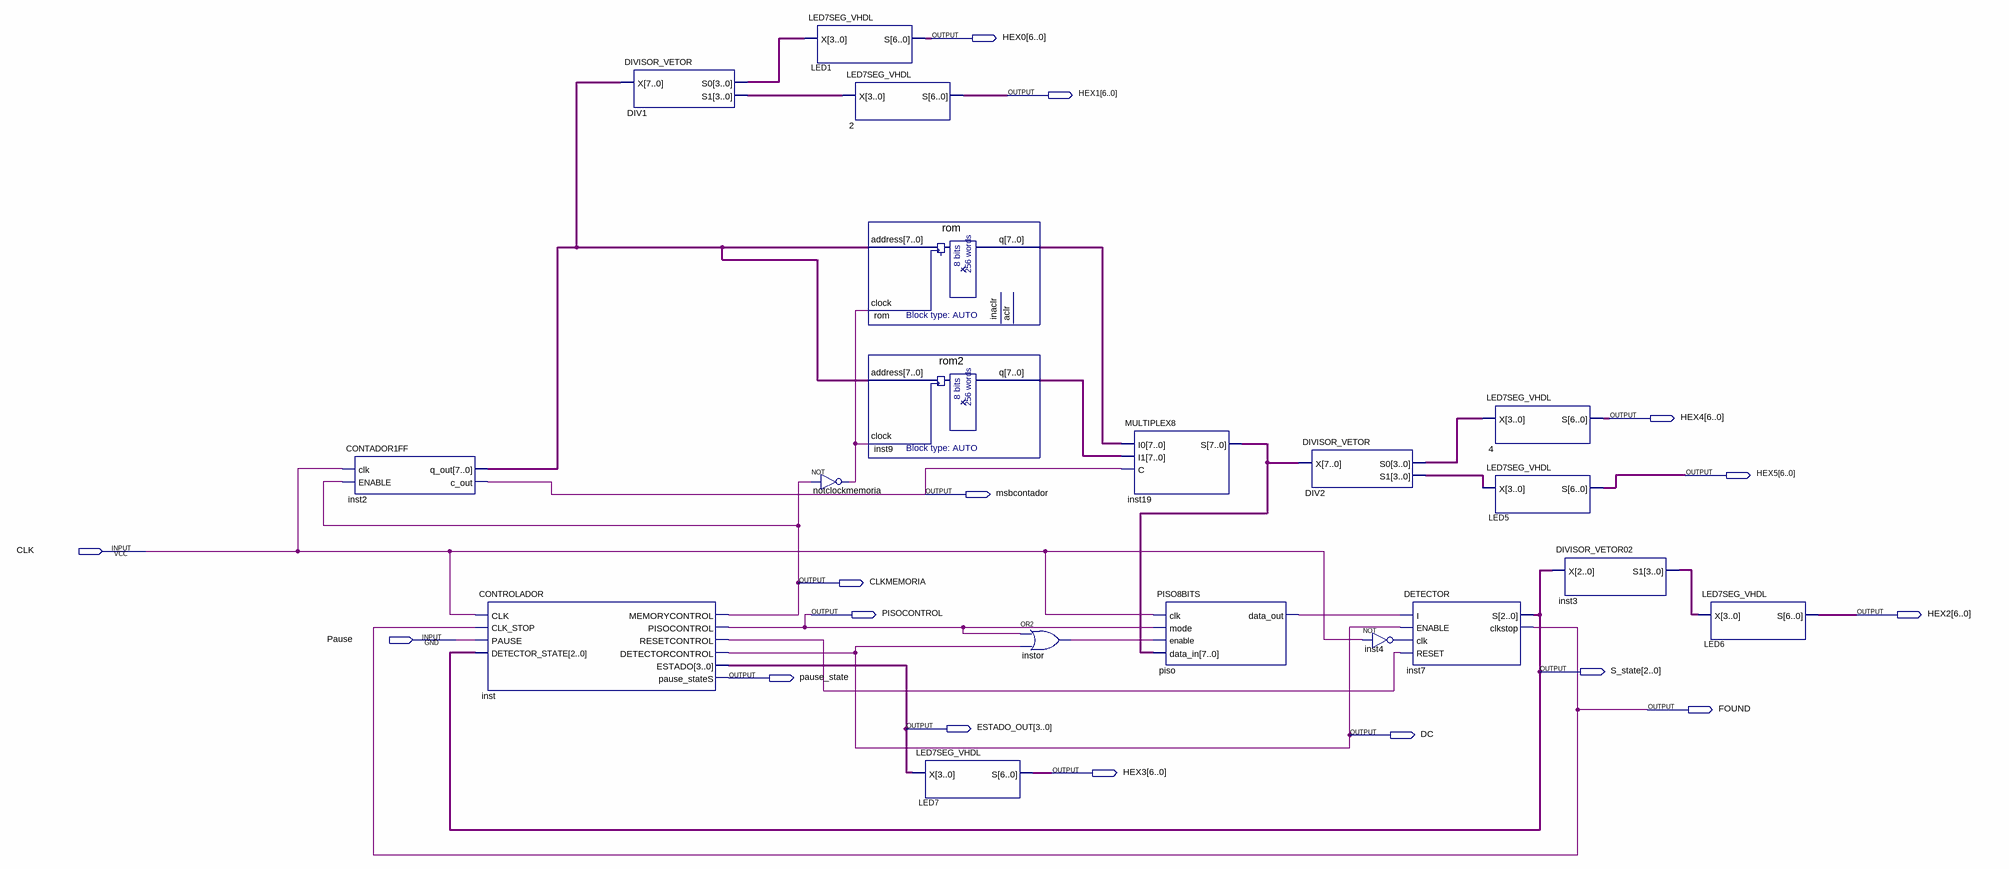
[diagram p0: schematic sheet]
// Quartus schematic lab07toptemp.bdf as structural Verilog: 19 symbols, 16 pins
module lab07toptemp (
  input  CLK,
  input  Pause,
  output [6:0] HEX0,
  output [6:0] HEX1,
  output [6:0] HEX4,
  output [6:0] HEX5,
  output msbcontador,
  output CLKMEMORIA,
  output PISOCONTROL,
  output [6:0] HEX2,
  output [2:0] S_state,
  output pause_state,
  output FOUND,
  output [3:0] ESTADO_OUT,
  output DC,
  output [6:0] HEX3
);

  wire inst4_out, inst_resetcontrol, instor_out, notclockmemoria_out, piso_data_out;
  wire [3:0] DIV1_s0, DIV1_s1, DIV2_s0, DIV2_s1, inst3_s1;
  wire [7:0] inst2_q_out, inst9_q, inst19_s, rom_q;

  CONTADOR1FF inst2 (.clk(CLK), .ENABLE(CLKMEMORIA), .q_out(inst2_q_out), .c_out(msbcontador));
  CONTROLADOR inst (
    .CLK(CLK), .CLK_STOP(FOUND), .PAUSE(Pause), .DETECTOR_STATE(S_state), .MEMORYCONTROL(CLKMEMORIA),
    .PISOCONTROL(PISOCONTROL), .RESETCONTROL(inst_resetcontrol), .DETECTORCONTROL(DC), .ESTADO(ESTADO_OUT),
    .pause_stateS(pause_state));
  DIVISOR_VETOR DIV1 (.X(inst2_q_out), .S0(DIV1_s0), .S1(DIV1_s1));
  LED7SEG_VHDL LED1 (.X(DIV1_s0), .S(HEX0));
  not notclockmemoria (notclockmemoria_out, CLKMEMORIA);
  LED7SEG_VHDL u_2 (.X(DIV1_s1), .S(HEX1));
  rom rom (.address(inst2_q_out), .clock(notclockmemoria_out), .q(rom_q));  // open: aclr, inaclr
  rom2 inst9 (.address(inst2_q_out), .clock(notclockmemoria_out), .q(inst9_q));
  LED7SEG_VHDL LED7 (.X(ESTADO_OUT), .S(HEX3));
  or instor (instor_out, PISOCONTROL, DC);
  MULTIPLEX8 inst19 (.I0(rom_q), .I1(inst9_q), .C(msbcontador), .S(inst19_s));
  PISO8BITS piso (.clk(CLK), .mode(PISOCONTROL), .enable(instor_out), .data_in(inst19_s), .data_out(piso_data_out));
  DIVISOR_VETOR DIV2 (.X(inst19_s), .S0(DIV2_s0), .S1(DIV2_s1));
  not inst4 (inst4_out, CLK);
  DETECTOR inst7 (
    .I(piso_data_out), .ENABLE(DC), .clk(inst4_out), .RESET(inst_resetcontrol), .S(S_state), .clkstop(FOUND));
  LED7SEG_VHDL u_4 (.X(DIV2_s0), .S(HEX4));
  LED7SEG_VHDL LED5 (.X(DIV2_s1), .S(HEX5));
  DIVISOR_VETOR02 inst3 (.X(S_state), .S1(inst3_s1));
  LED7SEG_VHDL LED6 (.X(inst3_s1), .S(HEX2));
endmodule
